# Altium project DATN_node_V3.PrjPcb
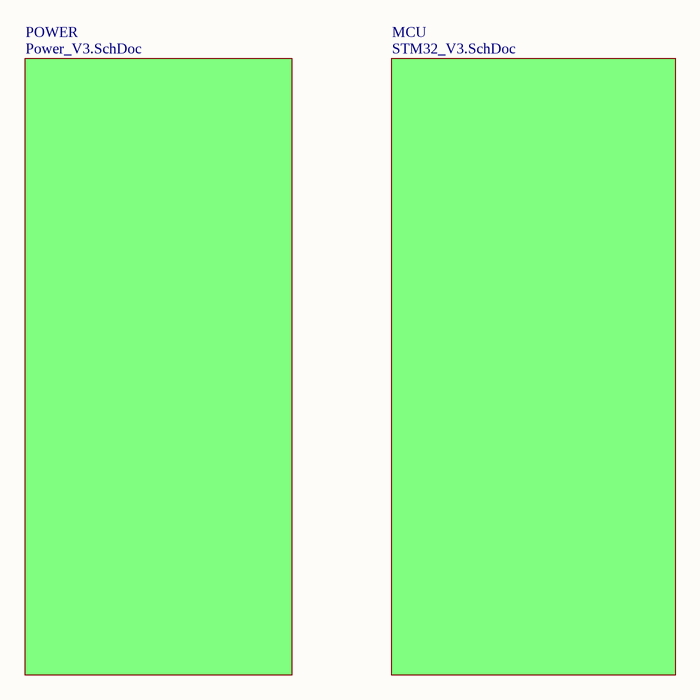
[diagram p0: Hard.SchDoc]
3 sheets, 68 parts. Net scope: global (net labels, ports and power ports of the same name join across sheets).
Board files: logo_bk.PcbDoc, Node_V3.PcbDoc
Sheets:
  Hard.SchDoc
    POWER = Power_V3.SchDoc
    MCU = STM32_V3.SchDoc

## Sheet Hard.SchDoc
size A

### Sub-sheets
MCU = STM32_V3.SchDoc: no entries
POWER = Power_V3.SchDoc: no entries

## Sheet Power_V3.SchDoc
size A
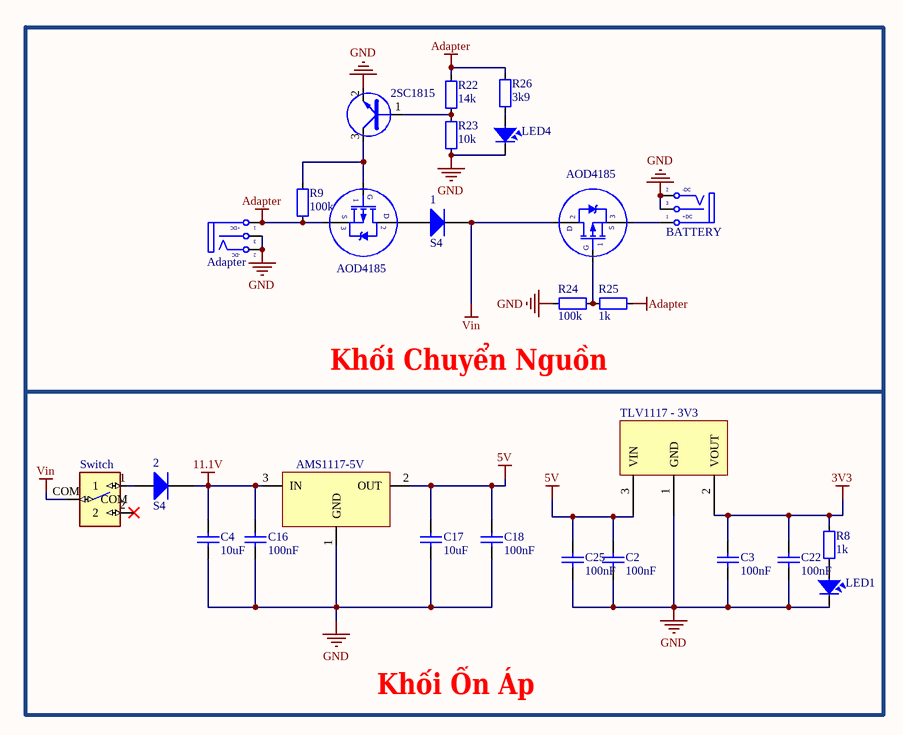
[diagram p1: Power_V3.SchDoc]

### Parts
1  S4  [DIO-214AC(SMA)]
2  S4  [DIO-214AC(SMA)]
C2  100nF  [CAP_0805]
C3  100nF  [CAP_0805]
C4  10uF  [CAP_0805]
C16  100nF  [CAP_0805]
C17  10uF  [CAP_0805]
C18  100nF  [CAP_0805]
C22  100nF  [CAP_0805]
C25  100nF  [CAP_0805]
IC2  AOD4185  [TO-252]
IC3  AOD4185  [TO-252]
JDC1  Adapter  [DC-IN]
JDC2  BATTERY  [DC-IN]
LED1  LED  [LED-0805-Blue]  (value not drawn)
LED4  LED  [LED-0805-Blue]  (value not drawn)
Power2  AMS1117-5V  [SOT223]
Q1  2SC1815  [SOT23D]
R8  1k  [RES-SMD-0805]
R9  100k  [RES-SMD-0805]
R22  14k  [RES-SMD-0805]
R23  10k  [RES-SMD-0805]
R24  100k  [RES-SMD-0805]
R25  1k  [RES-SMD-0805]
R26  3k9  [RES-SMD-0805]
Switch  SK12D07VG4  [SK12D07VG4]  (value not drawn)
TLV1117_-_3V3  LM1117- 5V  [SOT230P700X180-4N]  (value not drawn)

### Nets
3V3: C3.1 C22.1 R8.1 TLV1117_-_3V3.2(VOUT)
5V: C2.1 C17.1 C18.1 C25.1 Power2.2(OUT) TLV1117_-_3V3.3(VIN)
11.1V: 2.2(K) C4.1 C16.1 Power2.3(IN)
Adapter: IC2.3(S) JDC1.1(T) R9.1 R22.1 R25.1 R26.1
GND: C2.2 C3.2 C4.2 C16.2 C17.2 C18.2 C22.2 C25.2 JDC1.2(TN) JDC1.3(S) JDC2.2(TN) JDC2.3(S) LED1.2 LED4.2 Power2.1(GND) Q1.2(E) R23.2 R24.2 TLV1117_-_3V3.1(GND)
Vin: 1.2(K) IC3.2(D) Switch.COM
Net1_1: 1.1(A) IC2.2(D)
Net2_1: 2.1(A) Switch.1
NetIC2_1: IC2.1(G) Q1.3(C) R9.2
NetIC3_1: IC3.1(G) R24.1 R25.2
NetIC3_3: IC3.3(S) JDC2.1(T)
NetLED1_1: LED1.1 R8.2
NetLED4_1: LED4.1 R26.2
NetQ1_1: Q1.1(B) R22.2 R23.1

Not connected (* = marked no-connect by the designer): Switch 2*

### Notes on the sheet
- Khối Chuyển Nguồn
- Khối Ổn Áp
- (in symbol DCIN) +DC; -DC

### Library data of the parts
1 2 = Diode S4: Dán; Ten_Linh_Kien: Diode S4 SOD123 ( 1N5819 SOD123); Ma_Hang: MH005519; Don_Vi: Con; Ghi_Chu: *; Chung_Loai: Dán; Kieu_Chan: *
C2-C4 C16-C18 C22 C25 = CapSMD: Capacitor; Value: 33p; Published: 8-Jun-2000; LatestRevisionDate: 17-Jul-2002; LatestRevisionNote: Re-released for DXP Platform.; PackageReference: RAD-0.3; Publisher: Altium Limited
IC2 IC3 = MOSFET_P: Generic P Channel MOSFET
JDC1 JDC2 = DCIN: Jac DC input; Value: Jac DC
LED1 LED4 = LED: LED Single colour Green and Red; Value: LED 3 ly Single Colour
Power2 = LM1117: 800mA Low-Dropout Linear Regulator; Creator: Nguyen Ba Bien; Website: http://group3i.net
Q1 = C1815: NPN 600mW, ECB; Value: C1815
R8 R9 R22-R26 = Resistor - SMD: Resistor; Manufacturer: Generic Components; Class: Passive; Published: 08/06/2000; Publisher: Altium Hobart Technology Centre
Switch = SK12D07VG4: Switch Slide ON ON SPDT Side Slide 0.3A 30VDC PC Pins Bracket Mount/Through Hole Bulk; MF: C&K; Price: None; Check_prices: https://www.snapeda.com/parts/SK12D07VG4/C&K/view-part/6618061/?ref=eda; SnapEDA_Link: https://www.snapeda.com/parts/SK12D07VG4/C&K/view-part/6618061/?ref=snap; Package: None; Availability: Not in stock; MP: SK12D07VG4; Value: *
TLV1117_-_3V3 = LM1117

## Sheet STM32_V3.SchDoc
size A4
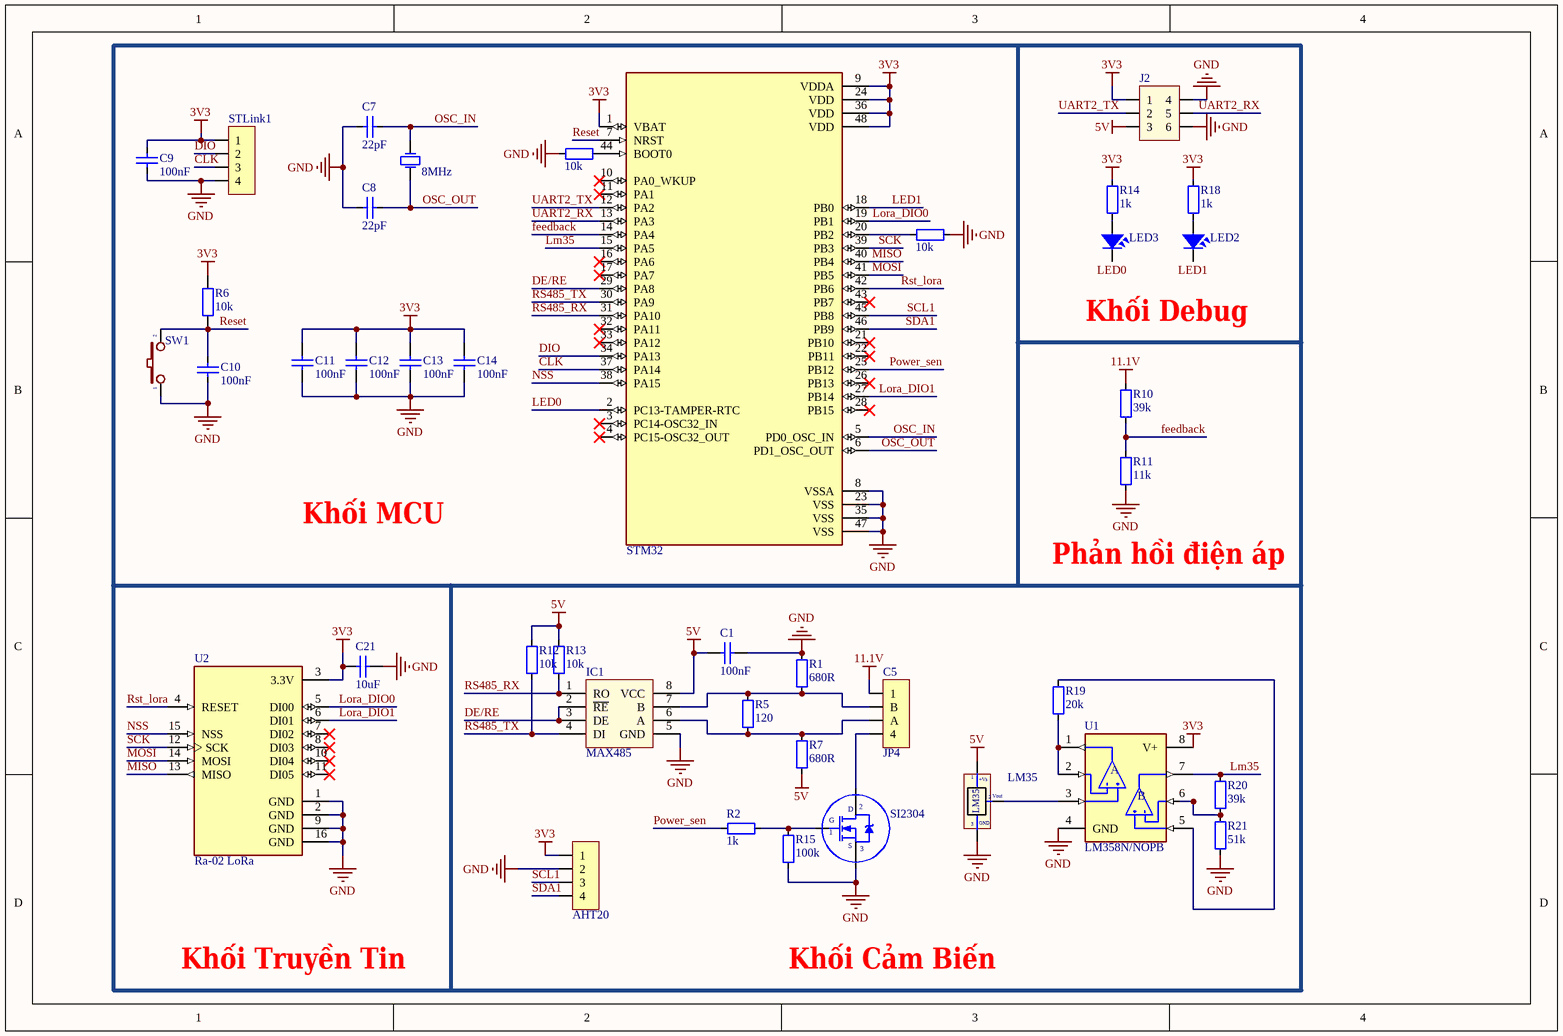
[diagram p2: STM32_V3.SchDoc]

### Parts
C1  100nF  [CAP_0805]
C5  JP4  [KF4-5.08]
C7  22pF  [CAP_0805]
C8  22pF  [CAP_0805]
C9  100nF  [CAP_0805]
C10  100nF  [CAP_0805]
C11  100nF  [CAP_0805]
C12  100nF  [CAP_0805]
C13  100nF  [CAP_0805]
C14  100nF  [CAP_0805]
C19  AHT20  [JP4-C1T]
C21  10uF  [CAP_0805]
IC1  MAX485  [SO-8]
J2  Connector 3x2  [JP3x2]  (value not drawn)
LED2  LED  [LED-0805-Blue]  (value not drawn)
LED3  LED  [LED-0805-Blue]  (value not drawn)
M1  SI2304  [SOT23A]
R1  680R  [RES-SMD-0805]
R2  1k  [RES-SMD-0805]
R3  10k  [RES-SMD-0805]
R5  120  [RES-SMD-0805]
R6  10k  [RES_SMD_0805]
R7  680R  [RES-SMD-0805]
R10  39k  [RES-SMD-0805]
R11  11k  [RES-SMD-0805]
R12  10k  [RES-SMD-0805]
R13  10k  [RES-SMD-0805]
R14  1k  [RES-SMD-0805]
R15  100k  [RES-SMD-0805]
R17  10k  [RES-SMD-0805]
R18  1k  [RES-SMD-0805]
R19  20k  [RES-SMD-0805]
R20  39k  [RES-SMD-0805]
R21  51k  [RES-SMD-0805]
STLink1  JP4  [JP4-C1T]  (value not drawn)
STM32  STM32  [LQFP 48]  (value not drawn)
SW1  SW  [SW-SMD]  (value not drawn)
U1  LM358N/NOPB  [SOIC8]
U2  Ra-02 LoRa  [Ra-02]
U3  LM35  [QTO-92]
Y1  8MHz  [XTAL]

### Nets
3V3: C9.1 C11.1 C12.1 C13.1 C14.1 C19.1 C21.1 J2.1 R6.1 R14.1 R18.1 STLink1.1 STM32.1(VBAT) STM32.9(VDDA) STM32.24(VDD) STM32.36(VDD) STM32.48(VDD) U1.8(V+) U2.3(3.3V)
5V: C1.1 IC1.8(VCC) J2.3 R7.2 R12.1 R13.1 U3.1(+Vs)
11.1V: C5.1 R10.1
GND: C1.2 C7.2 C8.2 C9.2 C10.2 C11.2 C12.2 C13.2 C14.2 C19.2 C21.2 IC1.5(GND) J2.4 J2.6 M1.3(S) R1.1 R3.1 R11.2 R15.1 R17.2 R21.2 STLink1.4 STM32.8(VSSA) STM32.23(VSS) STM32.35(VSS) STM32.47(VSS) SW1.1 U1.4(GND) U2.1(GND) U2.2(GND) U2.9(GND) U2.16(GND) U3.3(-)
CLK: STLink1.3 STM32.37(PA14)
DE/RE: IC1.2(~{RE}) IC1.3(DE) STM32.29(PA8)
DIO: STLink1.2 STM32.34(PA13)
feedback: R10.2 R11.1 STM32.14(PA4)
LED0: LED3.2 STM32.2(PC13-TAMPER-RTC)
LED1: LED2.2 STM32.18(PB0)
Lm35: R20.1 STM32.15(PA5) U1.7(OUTB)
Lora_DIO0: STM32.19(PB1) U2.5(DI00)
Lora_DIO1: STM32.27(PB14) U2.6(DI01)
MISO: STM32.40(PB4) U2.13(MISO)
MOSI: STM32.41(PB5) U2.14(MOSI)
NSS: STM32.38(PA15) U2.15(NSS)
OSC_IN: C7.1 STM32.5(PD0_OSC_IN) Y1.2(OSC2)
OSC_OUT: C8.1 STM32.6(PD1_OSC_OUT) Y1.1(OSC1)
Power_sen: R2.1 STM32.25(PB12)
Reset: C10.1 R6.2 STM32.7(NRST) SW1.2
RS485_RX: IC1.1(RO) R13.2 STM32.31(PA10)
RS485_TX: IC1.4(DI) R12.2 STM32.30(PA9)
Rst_lora: STM32.42(PB6) U2.4(RESET)
SCK: STM32.39(PB3) U2.12(SCK)
SCL1: C19.3 STM32.45(PB8)
SDA1: C19.4 STM32.46(PB9)
UART2_RX: J2.5 STM32.13(PA3)
UART2_TX: J2.2 STM32.12(PA2)
NetC5_2: C5.2(B) IC1.7(B) R1.2 R5.1
NetC5_3: C5.3(A) IC1.6(A) R5.2 R7.1
NetC5_4: C5.4 M1.2(D)
NetLED2_1: LED2.1 R18.2
NetLED3_1: LED3.1 R14.2
NetM1_1: M1.1(G) R2.2 R15.2
NetR3_2: R3.2 STM32.20(PB2)
NetR17_1: R17.1 STM32.44(BOOT0)
NetR19_1: R19.1 U1.5(+INB)
NetR19_2: R19.2 U1.1(OUTA) U1.2(-INA)
NetR20_2: R20.2 R21.1 U1.6(-INB)
NetU1_3: U1.3(+INA) U3.2(Vout)

Not connected (* = marked no-connect by the designer): STM32 3(PC14-OSC32_IN)* 4(PC15-OSC32_OUT)* 10(PA0_WKUP)* 11(PA1)* 16(PA6)* 17(PA7)* 21(PB10)* 22(PB11)* 26(PB13)* 28(PB15)* 32(PA11)* 33(PA12)* 43(PB7)*; U2 7(DI02)* 8(DI03)* 10(DI04)* 11(DI05)*

### Notes on the sheet
- Khối Debug
- Khối MCU
- Phản hồi điện áp
- Khối Truyền Tin
- Khối Cảm Biến
- (in symbol LM35) GND
- (in symbol LM358N/NOPB) A; B

### Library data of the parts
C1 C7-C14 C21 = CapSMD: Capacitor; Value: 33p; Published: 8-Jun-2000; LatestRevisionDate: 17-Jul-2002; LatestRevisionNote: Re-released for DXP Platform.; PackageReference: RAD-0.3; Publisher: Altium Limited
C5 C19 STLink1 = JP4: WR-PHD 2.54 mm Angled Socket Header; Manufacturer: W¨¹rth Elektronik eiSos GmbH; partNo: 613004143121; ComponentLink1 Description: Manufacturer; ComponentLink2 Description: Datasheet; NoPins: 04; Created Date: 29 March 2013; ComponentLink1URL: http://www.we-online.com; ComponentLink2URL: http://katalog.we-online.de/em/datasheet/6130xx143121.pdf; Created by: Karrer Zheng
IC1 = MAX485: RS232 - RS485 (Same sn75176)
J2 = JP3x2: Value: Connector 3x2
LED2 LED3 = LED: as LED1 on sheet Power_V3
M1 = MOSFET_N: Generic N Channel MOSFET
R1-R3 R5 R7 R10-R15 R17-R21 = Resistor - SMD: as R8 on sheet Power_V3; Published: 08/06/2000; Publisher: Altium Hobart Technology Centre
R6 = Resistor - SMD: Resistor SMD; Manufacturer: Generic Components; Class: Passive; Published: 08/06/2000; Publisher: Altium Hobart Technology Centre
STM32 = STM32F103C8T6: STM32 ARM-based 32-bit MCU with 64 Kbytes Flash, 64-pin LQFP, Industrial Temperature
SW1 = SW2: Switch button 2 pin; Value: SW chip 2 pin
U1 = LM358N/NOPB: General Purpose Amplifier 2 Circuit - 8-PDIP; MF: ON Semiconductor; MP: LM358N; SnapEDA_Link: https://www.snapeda.com/parts/LM358N/Onsemi/view-part/?ref=snap; Package: PDIP-8 ON Semiconductor; Value: *; Check_prices: https://www.snapeda.com/parts/LM358N/Onsemi/view-part/?ref=eda
U2 = Ra-02 LoRa: LoRa Module Ra-02
U3 = LM35: Teminal; Value: LM35
Y1 = XTAL: Crystal Oscillator; Published: 8-Jun-2000; LatestRevisionDate: 17-Jul-2002; LatestRevisionNote: Re-released for DXP Platform.; PackageReference: R38; Publisher: Altium Limited

## Nets that join several sheets
3V3: Power_V3 (C3.1 C22.1 R8.1 TLV1117_-_3V3.2), STM32_V3 (19 pins)
5V: Power_V3 (6 pins), STM32_V3 (7 pins)
11.1V: Power_V3 (2.2 C4.1 C16.1 Power2.3), STM32_V3 (C5.1 R10.1)
GND: Power_V3 (19 pins), STM32_V3 (33 pins)